# Altium schematic sheet JETSON AGX PCIE.SchDoc: Jetson AGX PCIe
size 279 x 215 mm; CheckedBy: Lance Bantoto; Engineer: Cindy Li, Chealsie Bains; DocumentNumber: 11; Revision: 1; SheetNumber: 11; SheetTotal: 23
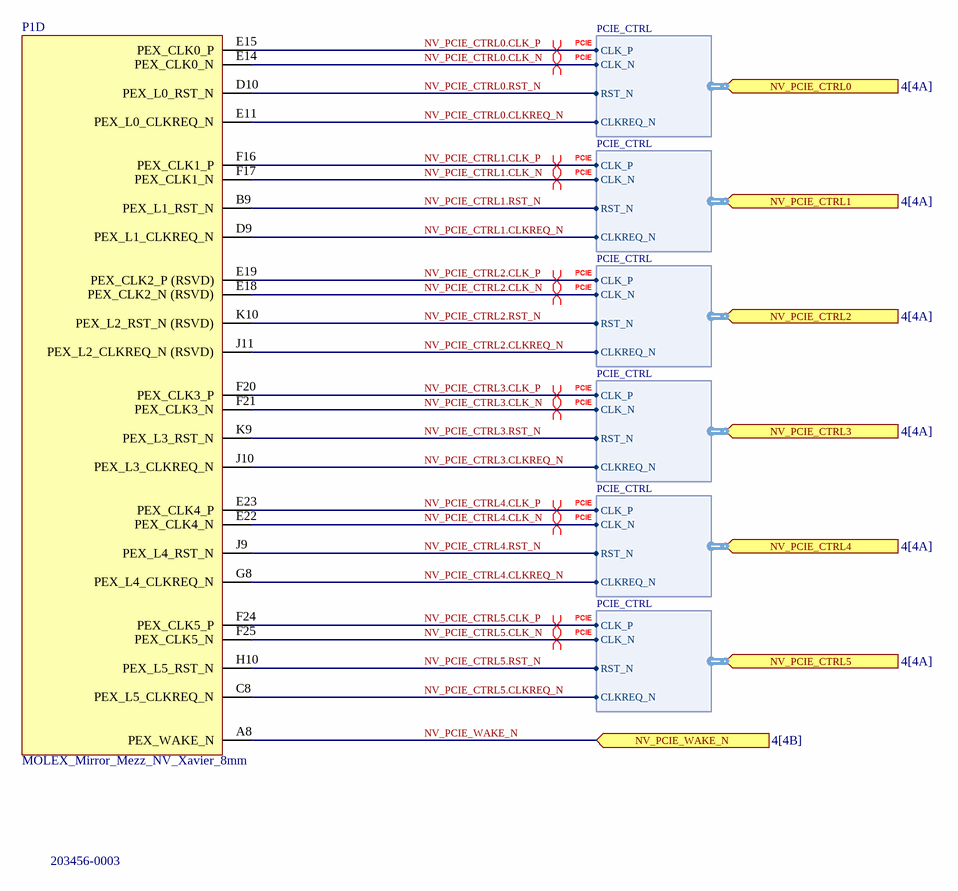
[diagram p0: JETSON AGX PCIE.SchDoc]

## Parts
P1  MOLEX_Mirror_Mezz_NV_Xavier_8mm  [203456-0003]  (part D of 15)

## Ports
NV_PCIE_CTRL0 (in, harness PCIE_CTRL, see 4[4A]), NV_PCIE_CTRL1 (in, harness PCIE_CTRL, see 4[4A]), NV_PCIE_CTRL2 (in, harness PCIE_CTRL, see 4[4A]), NV_PCIE_CTRL3 (in, harness PCIE_CTRL, see 4[4A]), NV_PCIE_CTRL4 (in, harness PCIE_CTRL, see 4[4A]), NV_PCIE_CTRL5 (in, harness PCIE_CTRL, see 4[4A]), NV_PCIE_WAKE_N (in, see 4[4B])

## Harnesses
PCIE_CTRL: CLK_P, CLK_N, RST_N, CLKREQ_N

## Nets
NV_PCIE_CTRL0.CLK_N: P1.E14(PEX_CLK0_N) ; port NV_PCIE_CTRL0.CLK_N
NV_PCIE_CTRL0.CLK_P: P1.E15(PEX_CLK0_P) ; port NV_PCIE_CTRL0.CLK_P
NV_PCIE_CTRL0.CLKREQ_N: P1.E11(PEX_L0_CLKREQ_N) ; port NV_PCIE_CTRL0.CLKREQ_N
NV_PCIE_CTRL0.RST_N: P1.D10(PEX_L0_RST_N) ; port NV_PCIE_CTRL0.RST_N
NV_PCIE_CTRL1.CLK_N: P1.F17(PEX_CLK1_N) ; port NV_PCIE_CTRL1.CLK_N
NV_PCIE_CTRL1.CLK_P: P1.F16(PEX_CLK1_P) ; port NV_PCIE_CTRL1.CLK_P
NV_PCIE_CTRL1.CLKREQ_N: P1.D9(PEX_L1_CLKREQ_N) ; port NV_PCIE_CTRL1.CLKREQ_N
NV_PCIE_CTRL1.RST_N: P1.B9(PEX_L1_RST_N) ; port NV_PCIE_CTRL1.RST_N
NV_PCIE_CTRL2.CLK_N: P1.E18(PEX_CLK2_N_(RSVD)) ; port NV_PCIE_CTRL2.CLK_N
NV_PCIE_CTRL2.CLK_P: P1.E19(PEX_CLK2_P_(RSVD)) ; port NV_PCIE_CTRL2.CLK_P
NV_PCIE_CTRL2.CLKREQ_N: P1.J11(PEX_L2_CLKREQ_N_(RSVD)) ; port NV_PCIE_CTRL2.CLKREQ_N
NV_PCIE_CTRL2.RST_N: P1.K10(PEX_L2_RST_N_(RSVD)) ; port NV_PCIE_CTRL2.RST_N
NV_PCIE_CTRL3.CLK_N: P1.F21(PEX_CLK3_N) ; port NV_PCIE_CTRL3.CLK_N
NV_PCIE_CTRL3.CLK_P: P1.F20(PEX_CLK3_P) ; port NV_PCIE_CTRL3.CLK_P
NV_PCIE_CTRL3.CLKREQ_N: P1.J10(PEX_L3_CLKREQ_N) ; port NV_PCIE_CTRL3.CLKREQ_N
NV_PCIE_CTRL3.RST_N: P1.K9(PEX_L3_RST_N) ; port NV_PCIE_CTRL3.RST_N
NV_PCIE_CTRL4.CLK_N: P1.E22(PEX_CLK4_N) ; port NV_PCIE_CTRL4.CLK_N
NV_PCIE_CTRL4.CLK_P: P1.E23(PEX_CLK4_P) ; port NV_PCIE_CTRL4.CLK_P
NV_PCIE_CTRL4.CLKREQ_N: P1.G8(PEX_L4_CLKREQ_N) ; port NV_PCIE_CTRL4.CLKREQ_N
NV_PCIE_CTRL4.RST_N: P1.J9(PEX_L4_RST_N) ; port NV_PCIE_CTRL4.RST_N
NV_PCIE_CTRL5.CLK_N: P1.F25(PEX_CLK5_N) ; port NV_PCIE_CTRL5.CLK_N
NV_PCIE_CTRL5.CLK_P: P1.F24(PEX_CLK5_P) ; port NV_PCIE_CTRL5.CLK_P
NV_PCIE_CTRL5.CLKREQ_N: P1.C8(PEX_L5_CLKREQ_N) ; port NV_PCIE_CTRL5.CLKREQ_N
NV_PCIE_CTRL5.RST_N: P1.H10(PEX_L5_RST_N) ; port NV_PCIE_CTRL5.RST_N
NV_PCIE_WAKE_N: P1.A8(PEX_WAKE_N) ; port NV_PCIE_WAKE_N

## Layout directives
differential pair; differential pair class PCIE; differential pair class PCIE_CLK0; differential pair class PCIE_CLK: NV_PCIE_CTRL0.CLK_N, NV_PCIE_CTRL0.CLK_P
differential pair; differential pair class PCIE; differential pair class PCIE_CLK1; differential pair class PCIE_CLK: NV_PCIE_CTRL1.CLK_N, NV_PCIE_CTRL1.CLK_P
differential pair; differential pair class PCIE; differential pair class PCIE_CLK2; differential pair class PCIE_CLK: NV_PCIE_CTRL2.CLK_N, NV_PCIE_CTRL2.CLK_P
differential pair; differential pair class PCIE; differential pair class PCIE_CLK3; differential pair class PCIE_CLK: NV_PCIE_CTRL3.CLK_N, NV_PCIE_CTRL3.CLK_P
differential pair; differential pair class PCIE; differential pair class PCIE_CLK4; differential pair class PCIE_CLK: NV_PCIE_CTRL4.CLK_N, NV_PCIE_CTRL4.CLK_P
differential pair; differential pair class PCIE; differential pair class PCIE_CLK5; differential pair class PCIE_CLK: NV_PCIE_CTRL5.CLK_N, NV_PCIE_CTRL5.CLK_P

## Notes on the sheet
- University of Waterloo Robotics Team
- 200 University Ave W
- REV
- PROJECT
- Waterloo, Ontario, Canada
- N2L 3G1
- DOCUMENT
- ENGINEER
- REVIEWER
- MODIFIED
- SHEET
- OF

## Library data of the parts
P1 = MOLEX_Mirror_Mezz_NV_Xavier_8mm: CONN SELF-MATE 699POS SMD GOLD; Manufacturer 1: Molex; Supplier 1: Digi-Key; Supplier Part Number 1: WM25528CT-ND; Manufacturer Part Number 1: 203456-0003